# Altium schematic sheet Control.SchDoc
size A4
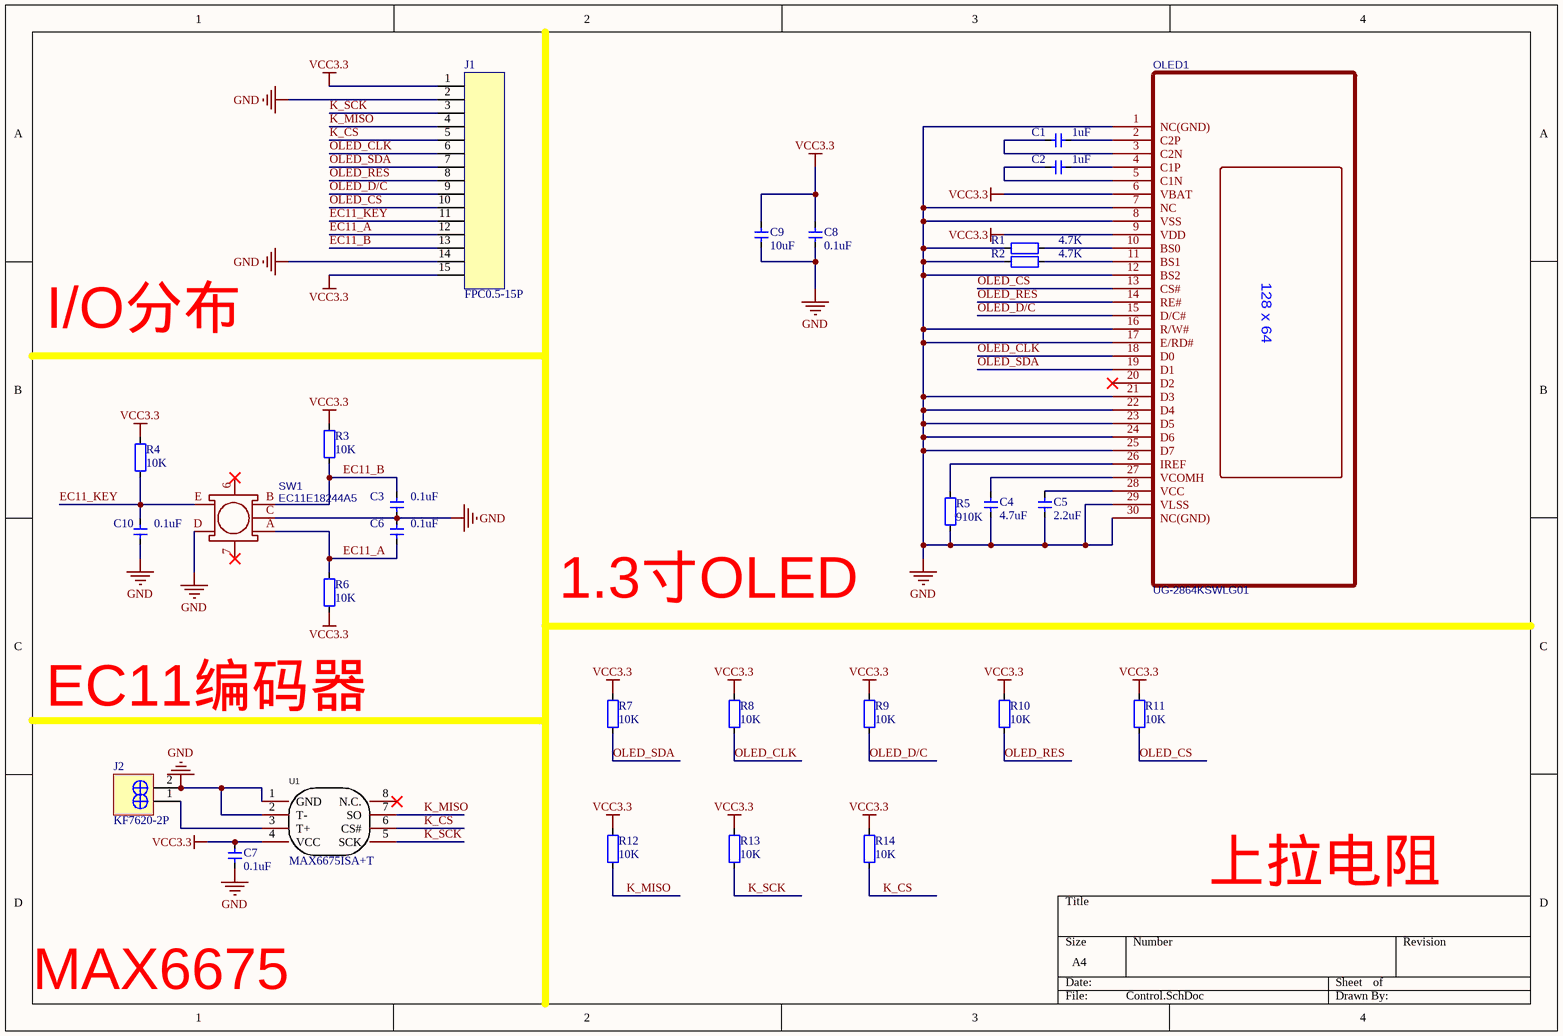
[diagram p0: Control.SchDoc]

## Parts
C1  1uF  [0603C]
C2  1uF  [0603C]
C3  0.1uF  [0603C]
C4  4.7uF  [0603C]
C5  2.2uF  [0603C]
C6  0.1uF  [0603C]
C7  0.1uF  [0603C]
C8  0.1uF  [0603C]
C9  10uF  [0603C]
C10  0.1uF  [0603C]
J1  FPC0.5-15P  [FPC0.5-15P]
J2  KF7620-2P  [KF7620-2P]
OLED1  UG-2864KSWLG01  [OLED-1.3]
R1  4.7K  [0603R]
R2  4.7K  [0603R]
R3  10K  [0603R]
R4  10K  [0603R]
R5  910K  [0603R]
R6  10K  [0603R]
R7  10K  [0603R]
R8  10K  [0603R]
R9  10K  [0603R]
R10  10K  [0603R]
R11  10K  [0603R]
R12  10K  [0603R]
R13  10K  [0603R]
R14  10K  [0603R]
SW1  EC11E18244A5  [SW-TH_EC11E18244A5]
U1  MAX6675ISA+T  [SOIC-8_L5.0-W4.0-P1.27-LS6.0-BL]

## Nets
GND: C3.1 C4.1 C5.1 C6.2 C7.1 C8.1 C9.1 C10.1 J1.2 J1.14 J2.2 OLED1.1(NC(GND)) OLED1.7(NC) OLED1.8(VSS) OLED1.12(BS2) OLED1.16(R/W#) OLED1.17(E/RD#) OLED1.21(D3) OLED1.22(D4) OLED1.23(D5) OLED1.24(D6) OLED1.25(D7) OLED1.29(VLSS) OLED1.30(NC(GND)) R1.1 R2.1 R5.1 SW1.C SW1.D U1.1(GND) U1.2(T-)
VCC3.3: C7.2 C8.2 C9.2 J1.1 J1.15 OLED1.6(VBAT) OLED1.9(VDD) R3.2 R4.2 R6.2 R7.2 R8.2 R9.2 R10.2 R11.2 R12.2 R13.2 R14.2 U1.4(VCC)
EC11_A: C6.1 J1.12 R6.1 SW1.A
EC11_B: C3.2 J1.13 R3.1 SW1.B
EC11_KEY: C10.2 J1.11 R4.1 SW1.E
K_CS: J1.5 R14.1 U1.6(CS#)
K_MISO: J1.4 R12.1 U1.7(SO)
K_SCK: J1.3 R13.1 U1.5(SCK)
OLED_CLK: J1.6 OLED1.18(D0) R8.1
OLED_CS: J1.10 OLED1.13(CS#) R11.1
OLED_D/C: J1.9 OLED1.15(D/C#) R9.1
OLED_RES: J1.8 OLED1.14(RE#) R10.1
OLED_SDA: J1.7 OLED1.19(D1) R7.1
NetC1_1: C1.1 OLED1.3(C2N)
NetC1_2: C1.2 OLED1.2(C2P)
NetC2_1: C2.1 OLED1.5(C1N)
NetC2_2: C2.2 OLED1.4(C1P)
NetC4_2: C4.2 OLED1.27(VCOMH)
NetC5_2: C5.2 OLED1.28(VCC)
NetJ2_1: J2.1 U1.3(T+)
NetOLED1_10: OLED1.10(BS0) R1.2
NetOLED1_11: OLED1.11(BS1) R2.2
NetOLED1_26: OLED1.26(IREF) R5.2

Not connected (* = marked no-connect by the designer): OLED1 20(D2)*; SW1 6* 7*; U1 8(N.C.)*

## Notes on the sheet
- I/O分布
- 1.3寸OLED
- EC11编码器
- 上拉电阻
- MAX6675
- (in symbol UG-2864KSWLG01) 128 x 64

## Library data of the parts
C1-C10 = CAP: 无极性电容
J1 = FPC0.5-15P: 贴片
OLED1 = UG-2864KSWLG01: BOM_Manufacturer: UG; BOM_Supplier: LCSC; BOM_Manufacturer Part: UG-2864KSWLG01; BOM_Supplier Part: C113322; spicePre: O; spiceSymbolName: UG-2864KSWLG01
R1-R14 = RES
SW1 = EC11E18244A5: BOM_Manufacturer: ALPS Electric; Contributor: LCSC; BOM_Supplier: LCSC; BOM_Supplier Part: C255515; BOM_Manufacturer Part: EC11E18244A5; spicePre: S; spiceSymbolName: EC11E18244A5
U1 = MAX6675ISA+T: Manufacturer: ADI(亚德诺); Add into BOM: yes; Supply Voltage: -300mV~6V; Resolution: 12; Interface Type: SPI; Chip Type Parameters/Description: 热电偶到数字转换器; Name: MAX6675ISA+T; Symbol: MAX6675ISA+T; Device: MAX6675ISA+T; LCSC Part Name: MAX6675ISA; Supplier Part: C16030; Manufacturer Part: MAX6675ISA+T; Supplier Footprint: SOIC-8; JLCPCB Part Class: Extended Part; Datasheet: https://atta.szlcsc.com/upload/public/pdf/source/20170713/C16030_1499918913843816819.pdf; Supplier: LCSC; Convert to PCB: yes; Number of Channels: -; Operating Temperature: -20℃~+85℃